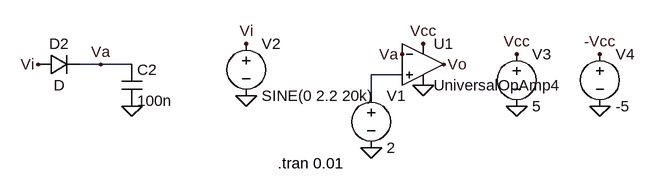
[diagram p0: schematic comparator.asc]
comparator.asc, the LTspice schematic file:
Version 4
SHEET 1 880 680
WIRE -240 128 -272 128
WIRE -192 128 -240 128
WIRE 224 144 176 144
WIRE 176 176 176 144
FLAG 256 160 0
FLAG 256 96 Vcc
FLAG 176 256 0
FLAG 224 112 Va
FLAG 288 128 Vo
FLAG -16 176 0
FLAG -16 96 Vi
FLAG 400 192 0
FLAG 400 112 Vcc
FLAG 528 192 0
FLAG 528 112 -Vcc
FLAG -192 192 0
FLAG -240 128 Va
FLAG -336 128 Vi
SYMBOL OpAmps\\UniversalOpAmp4 256 128 R0
SYMATTR InstName U1
SYMBOL voltage 176 160 R0
WINDOW 123 0 0 Left 0
WINDOW 39 0 0 Left 0
SYMATTR InstName V1
SYMATTR Value 2
SYMBOL voltage -16 80 R0
WINDOW 123 0 0 Left 0
WINDOW 39 0 0 Left 0
SYMATTR InstName V2
SYMATTR Value SINE(0 2.2 20k)
SYMBOL voltage 400 96 R0
WINDOW 123 0 0 Left 0
WINDOW 39 0 0 Left 0
SYMATTR InstName V3
SYMATTR Value 5
SYMBOL voltage 528 96 R0
WINDOW 123 0 0 Left 0
WINDOW 39 0 0 Left 0
SYMATTR InstName V4
SYMATTR Value -5
SYMBOL diode -336 144 R270
WINDOW 0 32 32 VTop 2
WINDOW 3 0 32 VBottom 2
SYMATTR InstName D2
SYMBOL cap -208 128 R0
SYMATTR InstName C2
SYMATTR Value 100n
TEXT 32 280 Left 2 !.tran 0.01

The netlist it stands for:
* comparator.asc
* U1: UniversalOpAmp4 (symbol OpAmps\UniversalOpAmp4 not available, pins judged from their places): In+=N001 In-=Va V+=Vcc V-=0 OUT=Vo
V1 N001 0 2
V2 Vi 0 SINE(0 2.2 20k)
V3 Vcc 0 5
V4 -Vcc 0 -5
D2 Vi Va D
C2 Va 0 100n
.model D D
.lib standard.dio
.tran 0.01
.backanno
.end